# Altium project telem_gsm.PrjPcb
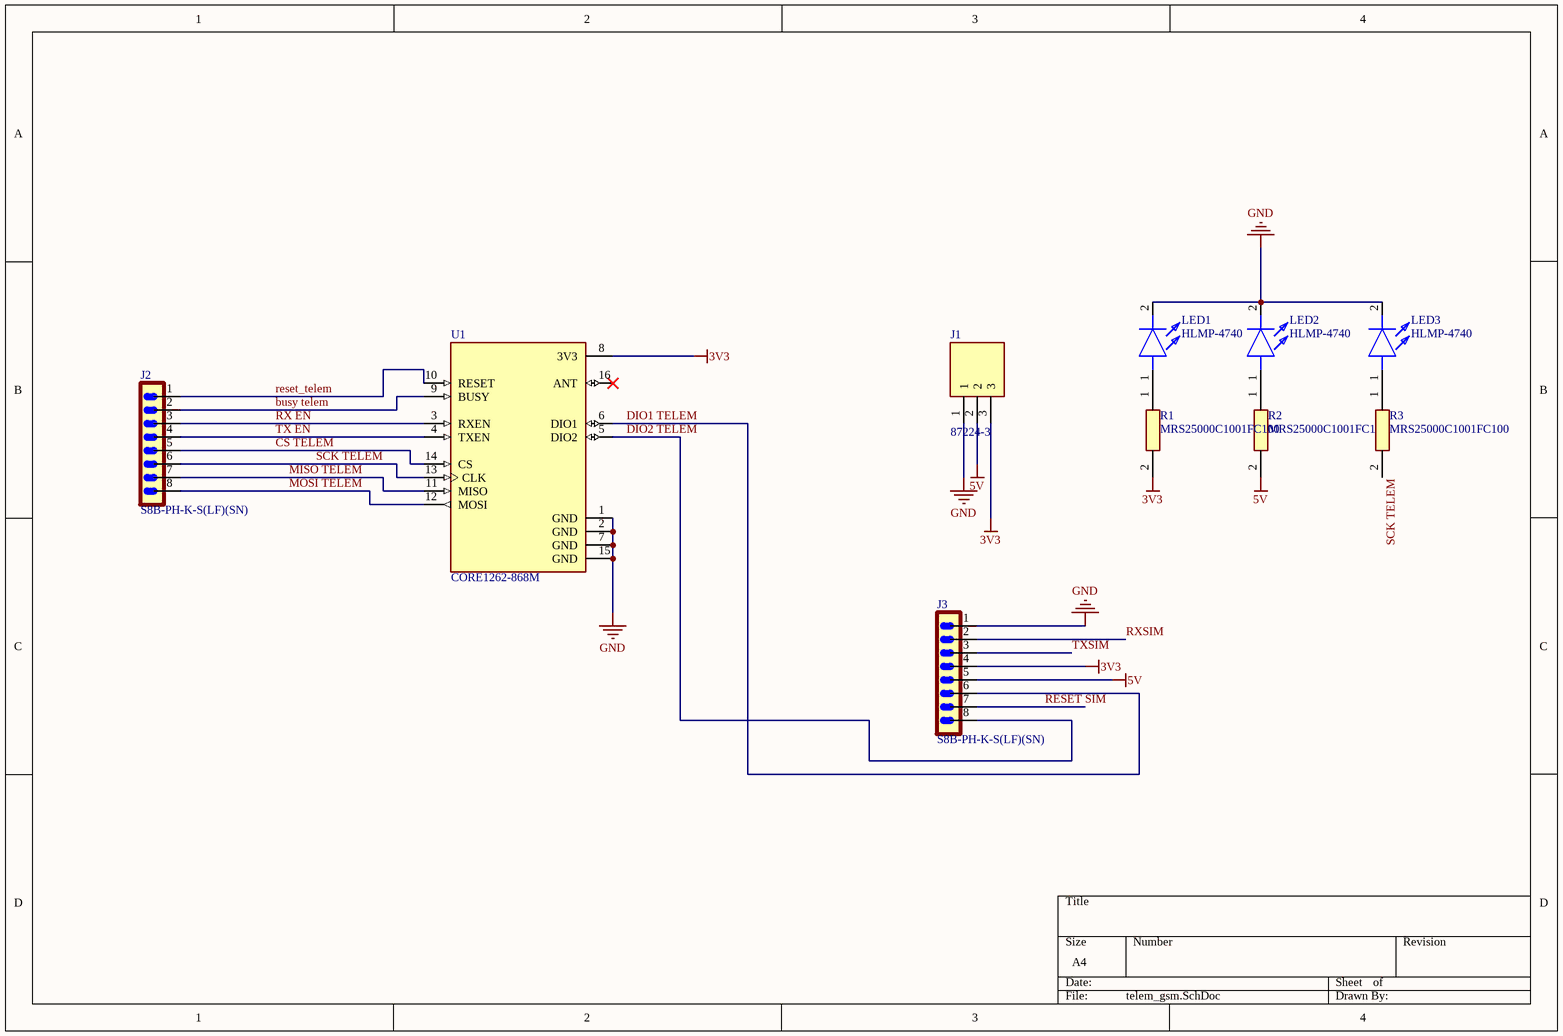
[diagram p0: telem_gsm.SchDoc]
1 sheet, 10 parts. Net scope: global (net labels, ports and power ports of the same name join across sheets).
Board file: telem_gsm.PcbDoc

## Sheet telem_gsm.SchDoc
size A4; SheetNumber: 1; SheetTotal: 1

### Parts
J1  87224-3  [872243]
J2  S8B-PH-K-S(LF)(SN)  [DW08R]
J3  S8B-PH-K-S(LF)(SN)  [DW08R]
LED1  HLMP-4740  [HLMP4740]
LED2  HLMP-4740  [HLMP4740]
LED3  HLMP-4740  [HLMP4740]
R1  MRS25000C1001FC100  [RESAD1650W60L650D250]
R2  MRS25000C1001FC100  [RESAD1650W60L650D250]
R3  MRS25000C1001FC100  [RESAD1650W60L650D250]
U1  CORE1262-868M  [XCVR_CORE1262-868M]

### Nets
3V3: J1.3 J3.4 R1.2 U1.8(3V3)
5V: J1.2 J3.5 R2.2
GND: J1.1 J3.1 LED1.2(K) LED2.2(K) LED3.2(K) U1.1(GND) U1.2(GND) U1.7(GND) U1.15(GND)
busy telem: J2.2 U1.9(BUSY)
CS TELEM: J2.5 U1.14(CS)
DIO1 TELEM: J3.6 U1.6(DIO1)
DIO2 TELEM: J3.8 U1.5(DIO2)
MISO TELEM: J2.7 U1.11(MISO)
MOSI TELEM: J2.8 U1.12(MOSI)
RESET SIM: J3.7
reset_telem: J2.1 U1.10(RESET)
RX EN: J2.3 U1.3(RXEN)
RXSIM: J3.2
SCK TELEM: J2.6 R3.2 U1.13(CLK)
TX EN: J2.4 U1.4(TXEN)
TXSIM: J3.3
NetLED1_1: LED1.1(A) R1.1
NetLED2_1: LED2.1(A) R2.1
NetLED3_1: LED3.1(A) R3.1

Not connected (* = marked no-connect by the designer): U1 16(ANT)*

### Library data of the parts
J1 = 87224-3: Connector; Manufacturer_Name: TE Connectivity; Datasheet Link: https://datasheet.datasheetarchive.com/originals/distributors/Datasheets_SAMA/3b9b08c08f06dc562fe3ba32b60fa864.pdf; Height: 10.3632mm; Manufacturer_Part_Number: 87224-3; Mouser Part Number: 571-872243; Mouser Price/Stock: https://www.mouser.co.uk/ProductDetail/TE-Connectivity/87224-3?qs=VKrXD49J9ErediZOfWku7Q%3D%3D; Arrow Part Number: 87224-3; Arrow Price/Stock: https://www.arrow.com/en/products/87224-3/te-connectivity?region=nac
J2 J3 = S8B-PH-K-S(LF)(SN): ç©´ã‚’é€šã‚‹ã‚³ãƒã‚¯ã‚¿ãƒ˜ãƒƒãƒ€ãƒ¼ã€å³è§’åº¦8ä½ç½®0.079 (2.00mm)ã€‚; MF: JST Sales; Package: NON STANDARD-8 J.S.T.; Price: None; Value: *; SnapEDA_Link: https://www.snapeda.com/parts/S8B-PH-K-S%20(LF)(SN)/JST+Sales+America+Inc./view-part/?ref=snap; MP: S8B-PH-K-S (LF)(SN); Availability: In Stock; Check_prices: https://www.snapeda.com/parts/S8B-PH-K-S%20(LF)(SN)/JST+Sales+America+Inc./view-part/?ref=eda
LED1-LED3 = HLMP-4740: LED; Manufacturer_Name: Avago Technologies; Datasheet Link: https://docs.broadcom.com/docs/AV02-1557EN; Height: 9.19mm; Manufacturer_Part_Number: HLMP-4740; Mouser Part Number: 630-HLMP-4740; Mouser Price/Stock: https://www.mouser.co.uk/ProductDetail/Broadcom-Avago/HLMP-4740?qs=jT9z6tsiFNlbkh2eYMYS%2Fw%3D%3D
R1-R3 = MRS25000C1001FC100: Resistor; Manufacturer_Name: Vishay; Datasheet Link: http://www.vishay.com/docs/28724/mrs16m25.pdf; Manufacturer_Part_Number: MRS25000C1001FC100; Mouser Part Number: 594-MRS25000C1001FC1; Mouser Price/Stock: https://www.mouser.co.uk/ProductDetail/Vishay-BC-Components/MRS25000C1001FC100?qs=H30XFsNYD%2FEk7X0%2FV%252BraxQ%3D%3D; Arrow Part Number: MRS25000C1001FC100; Arrow Price/Stock: https://www.arrow.com/en/products/mrs25000c1001fc100/vishay
U1 = CORE1262-868M: Lora core module; MF: Waveshare Electronics; Package: Package; Value: *; Check_prices: https://www.snapeda.com/parts/Core1262-868M/Waveshare+Electronics/view-part/?ref=eda; SnapEDA_Link: https://www.snapeda.com/parts/Core1262-868M/Waveshare+Electronics/view-part/?ref=snap; Availability: Not in stock; Price: None; MP: Core1262-868M